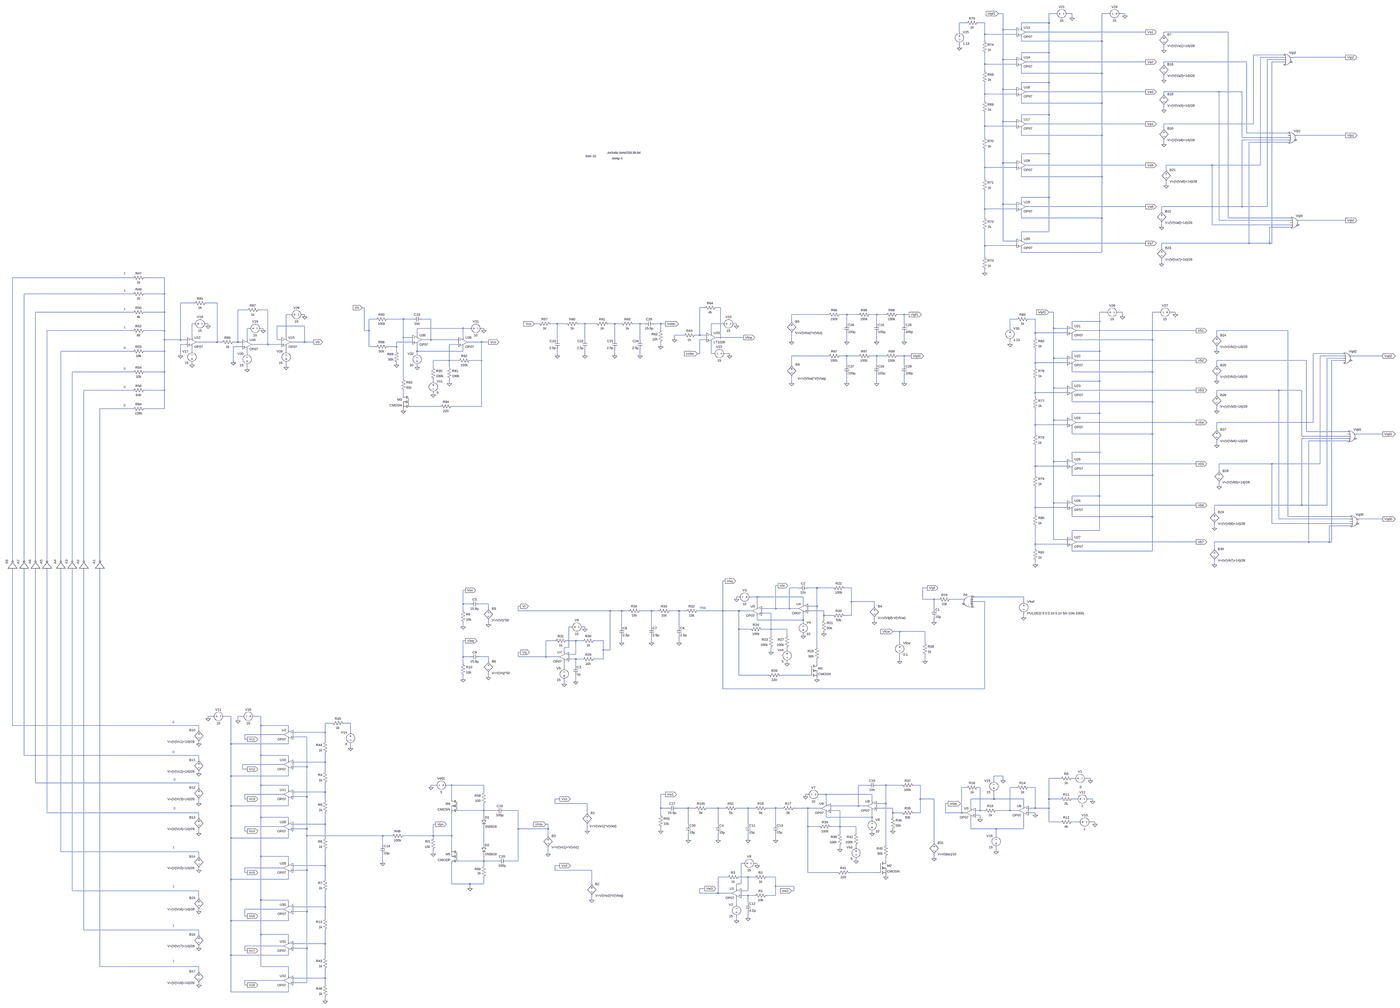
[diagram p0: schematic Internship.asc, whole sheet]
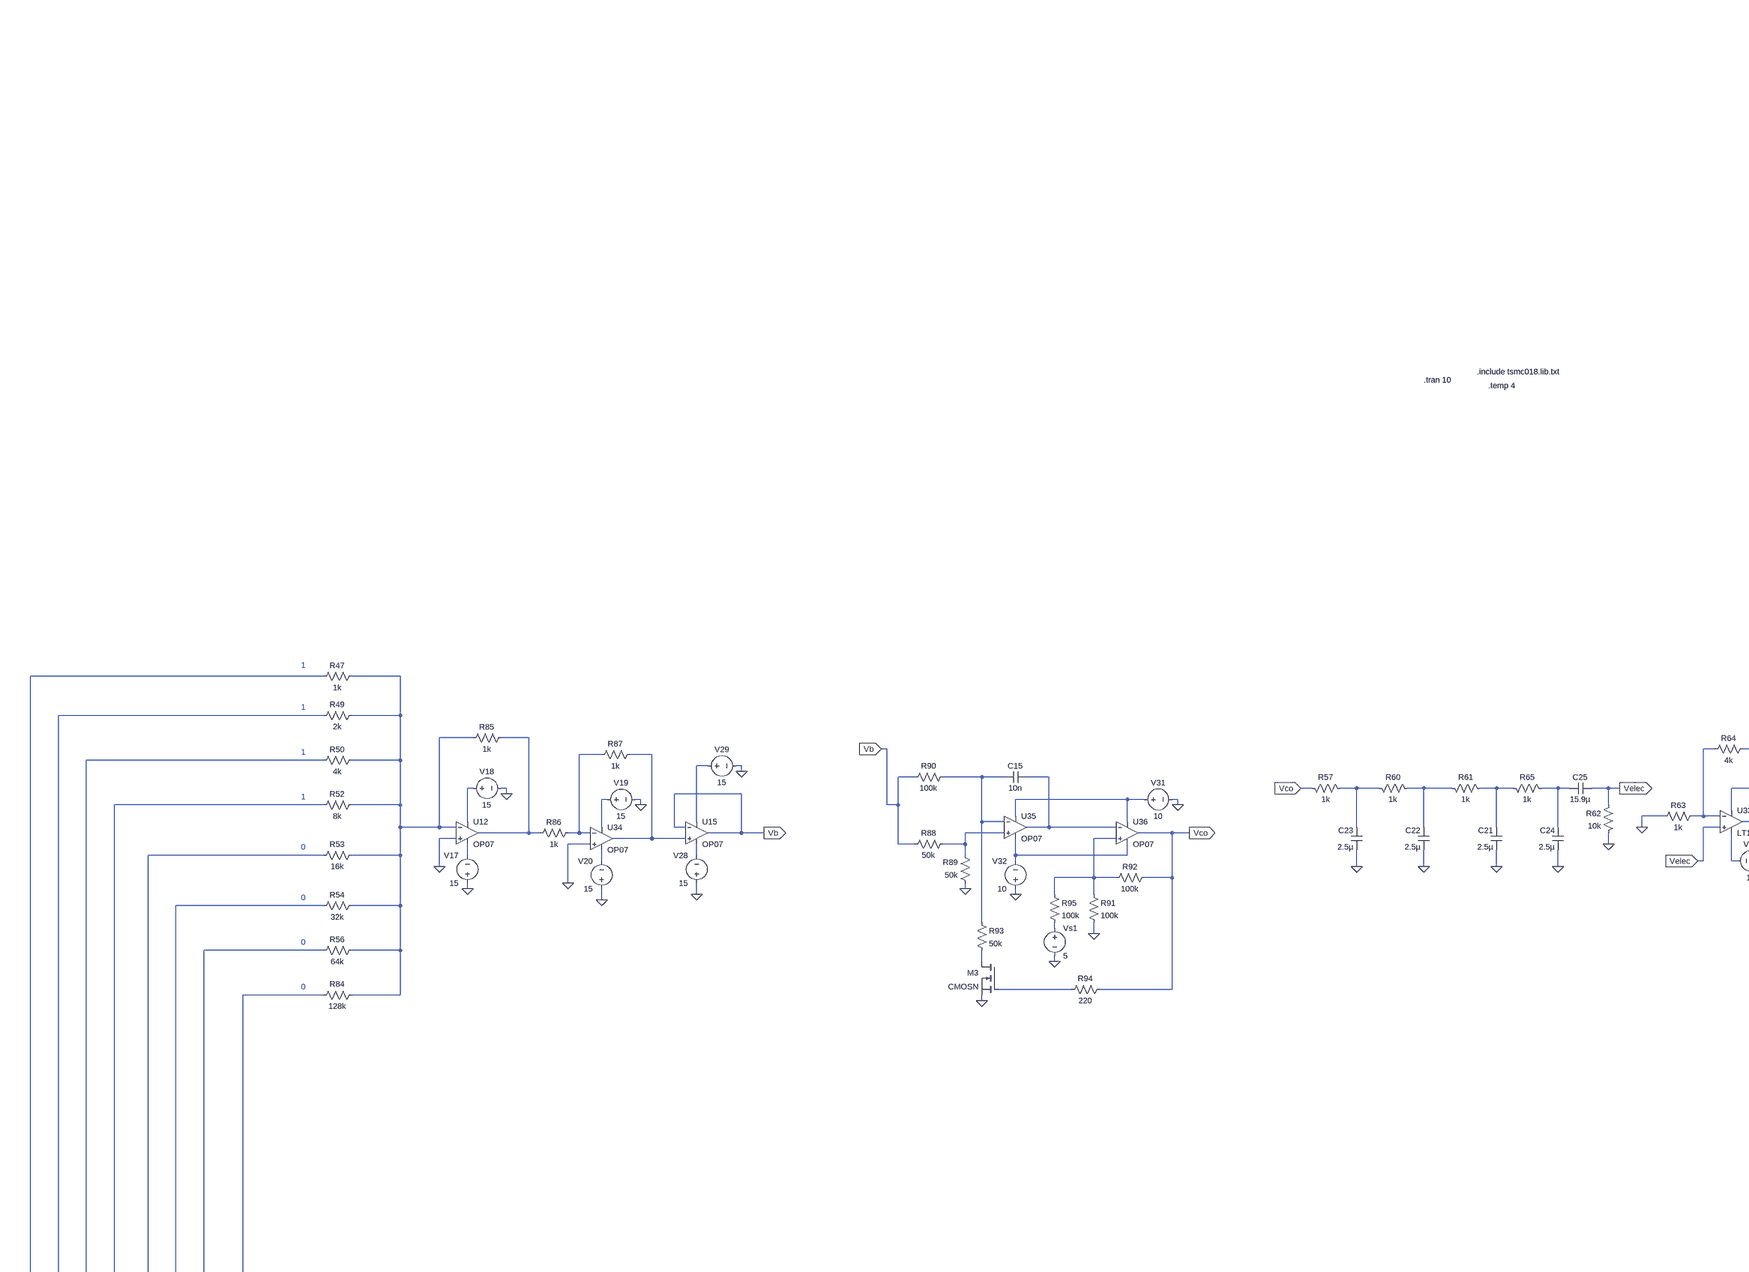
[diagram p1: schematic Internship.asc, part, row 1 of 2, column 1 of 2]
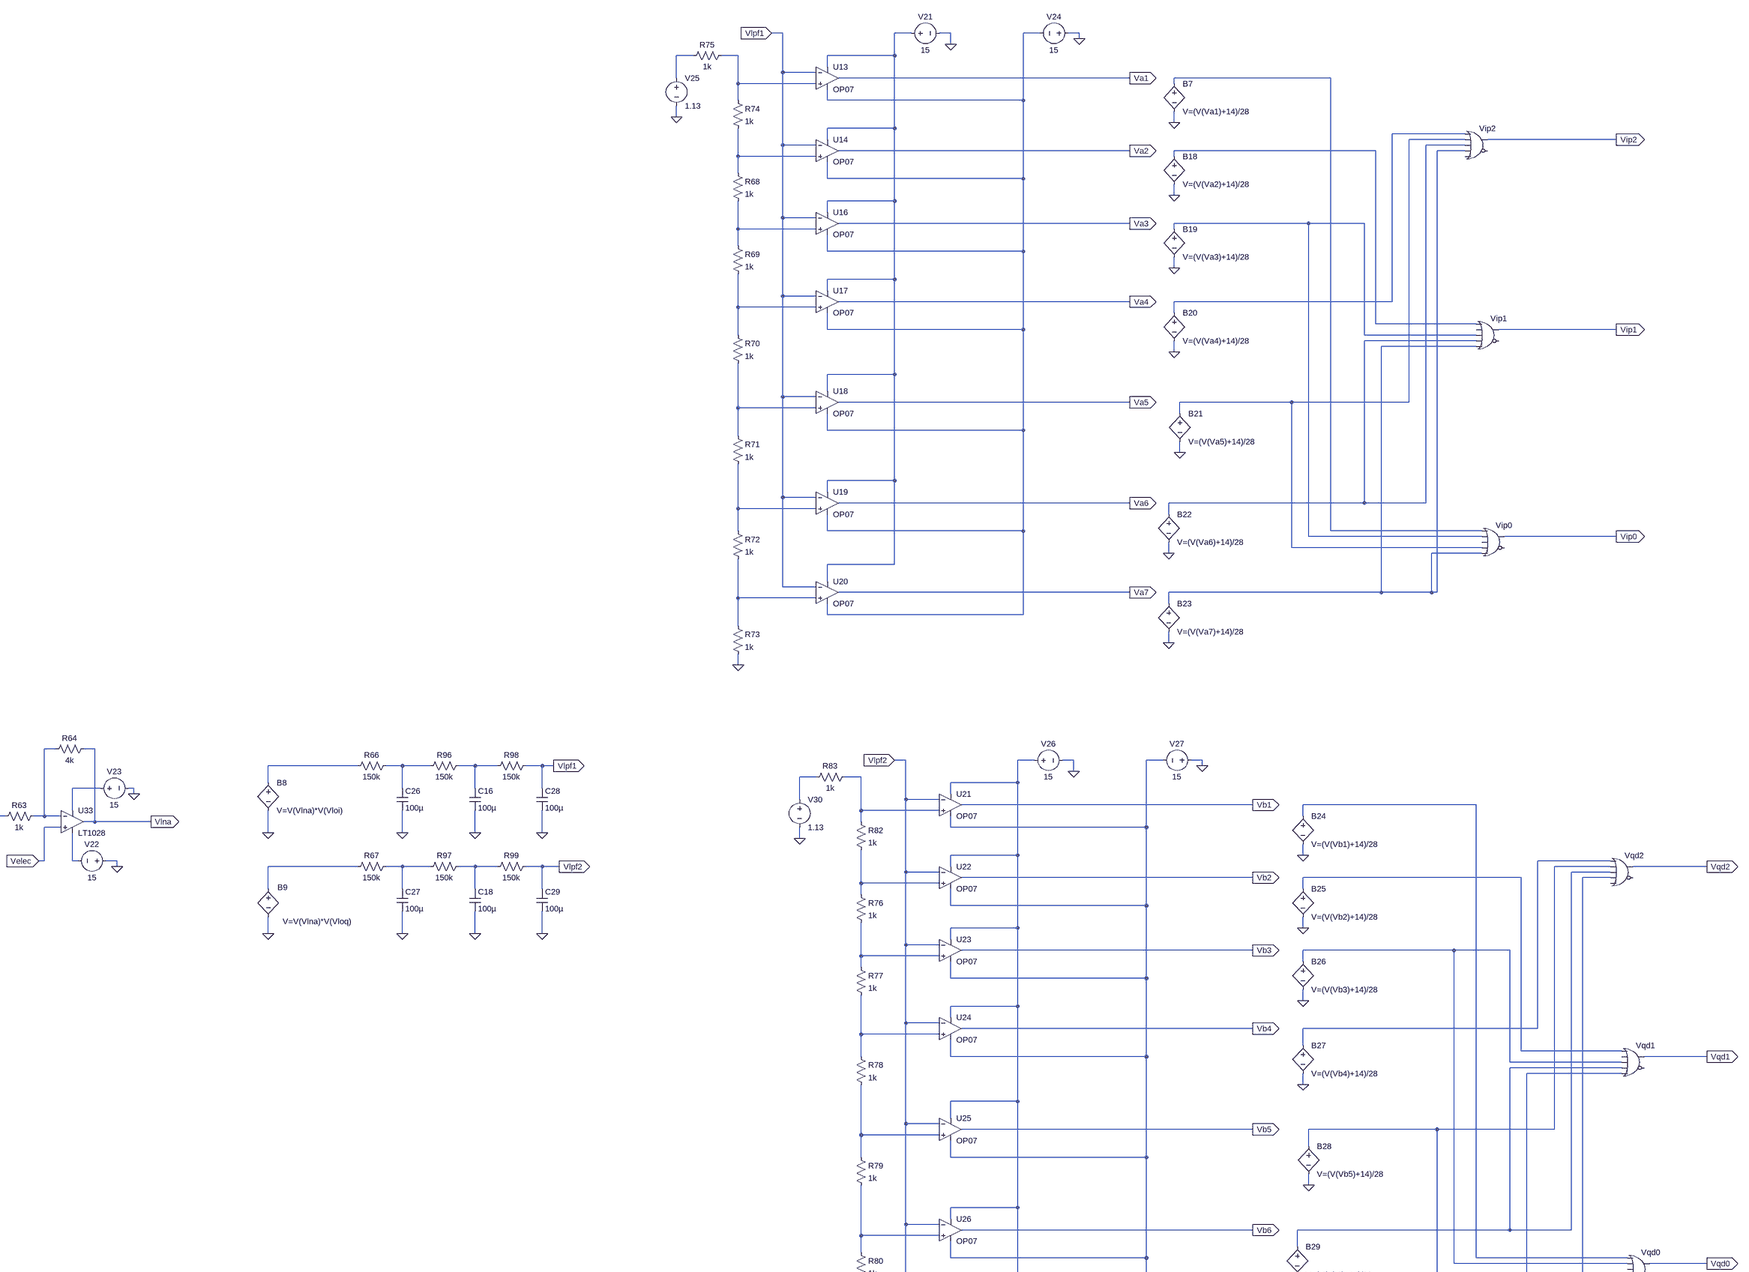
[diagram p2: schematic Internship.asc, part, row 1 of 2, column 2 of 2]
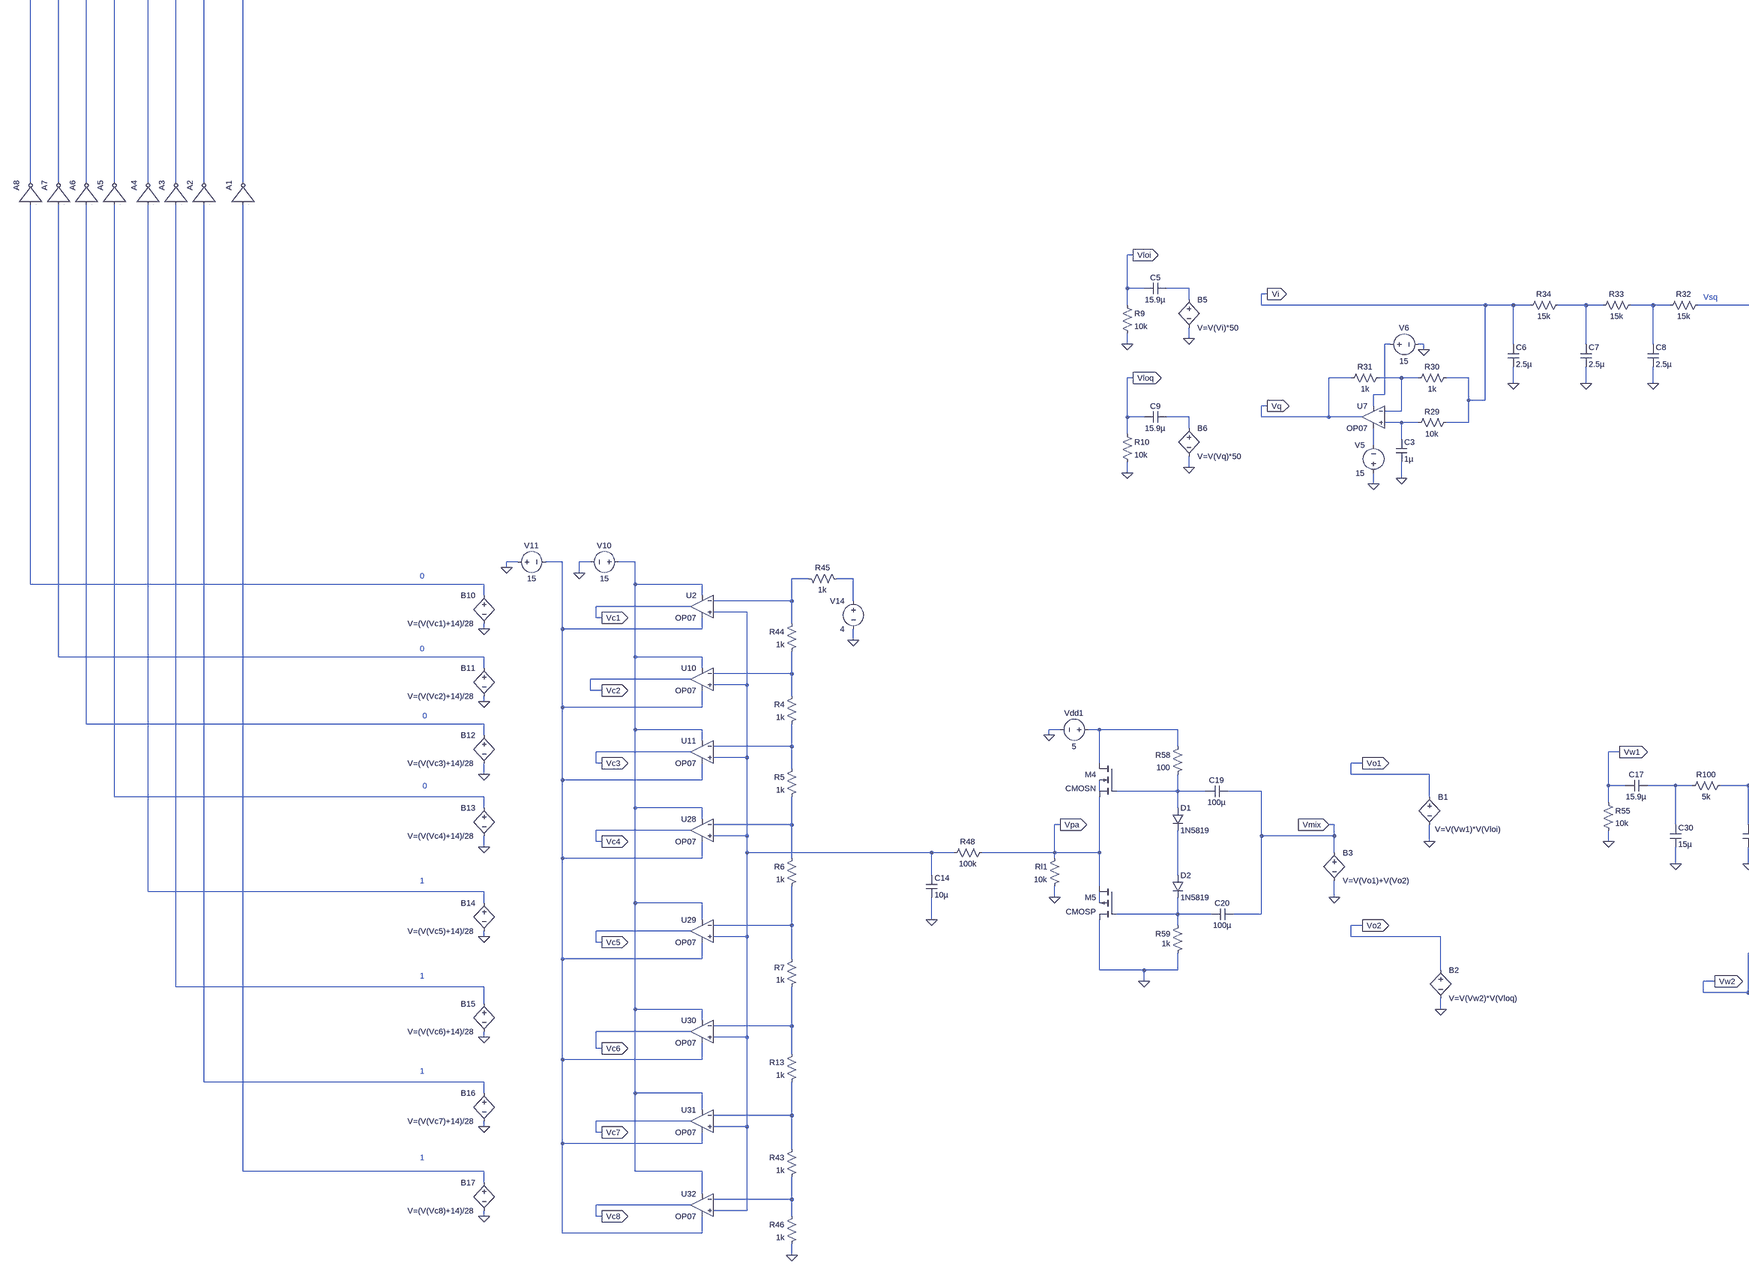
[diagram p3: schematic Internship.asc, part, row 2 of 2, column 1 of 2]
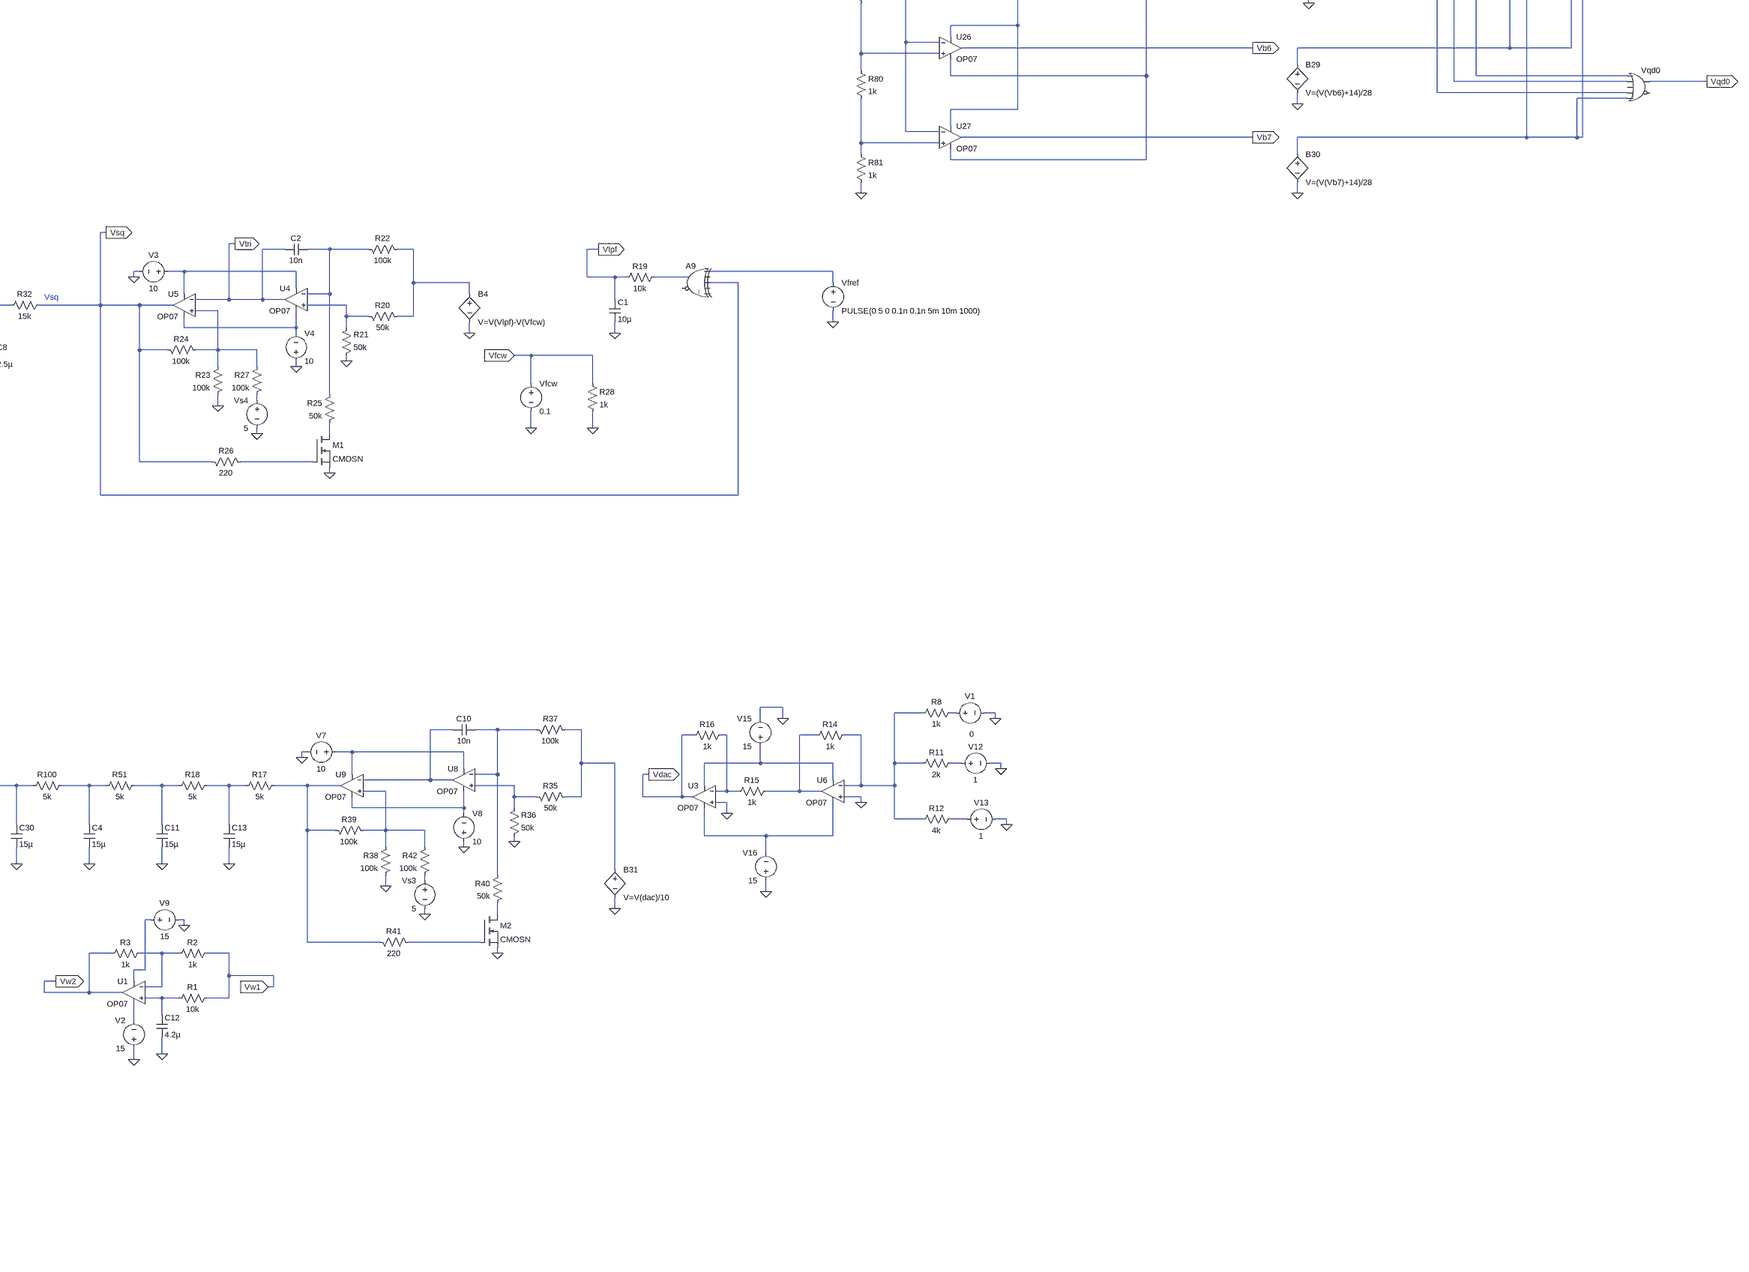
[diagram p4: schematic Internship.asc, part, row 2 of 2, column 2 of 2]
* Internship.asc
X§U3 0 N109 N113 N128 Vdac LT1001  ; OP07, pins In+ In- V+ V- OUT
X§U6 0 N102 N113 N128 N110 LT1001  ; OP07, pins In+ In- V+ V- OUT
R8 N103 N102 1k
R11 N114 N102 2k
R12 N126 N102 4k
V1 N103 0 0
V12 N114 0 1
V13 N126 0 1
R14 N102 N110 1k
R15 N110 N109 1k
R16 N109 Vdac 1k
V15 N113 0 15
V16 0 N128 15
B1 Vo1 0 V=V(Vw1)*V(Vloi)
B2 Vo2 0 V=V(Vw2)*V(Vloq)
Vfref N078 0 PULSE(0 5 0 0.1n 0.1n 5m 10m 1000)
A9 N078 0 Vsq 0 0 0 N079 0 XOR
R19 N079 Vlpf 10k
C1 Vlpf 0 10µ
X§U4 N083 N075 N077 N085 Vtri LT1001  ; OP07, pins In+ In- V+ V- OUT
X§U5 N084 Vtri N077 N085 Vsq LT1001  ; OP07, pins In+ In- V+ V- OUT
R20 N083 N076 50k
R21 0 N083 50k
R22 N075 N076 100k
C2 Vtri N075 10n
R23 N084 0 100k
R24 Vsq N084 100k
R25 N075 N091 50k
R26 Vsq N093 220
V3 N077 0 10
V4 0 N085 10
M1 N091 N093 0 0 CMOSN
R27 N084 N088 100k
Vs4 N088 0 5
B4 N076 0 V=V(Vlpf)-V(Vfcw)
Vfcw Vfcw 0 0.1
R28 Vfcw 0 1k
X§U7 N090 N087 N086 N092 Vq LT1001  ; OP07, pins In+ In- V+ V- OUT
C3 N090 0 1µ
R29 Vi N090 10k
R30 Vi N087 1k
R31 N087 Vq 1k
V5 0 N092 15
V6 N086 0 15
R32 Vsq N082 15k
R33 N082 N081 15k
R34 N081 Vi 15k
C6 Vi 0 2.5µ
C7 N081 0 2.5µ
C8 N082 0 2.5µ
B5 N080 0 V=V(Vi)*50
B6 N089 0 V=V(Vq)*50
X§U8 N120 N107 N112 N125 N106 LT1001  ; OP07, pins In+ In- V+ V- OUT
X§U9 N123 N106 N112 N125 N119 LT1001  ; OP07, pins In+ In- V+ V- OUT
R35 N120 N108 50k
R36 0 N120 50k
R37 N107 N108 100k
C10 N106 N107 10n
R38 N123 0 100k
R39 N119 N123 100k
R40 N107 N134 50k
R41 N119 N137 220
V7 N112 0 10
V8 0 N125 10
M2 N134 N137 0 0 CMOSN
R42 N123 N130 100k
Vs3 N130 0 5
C5 N080 Vloi 15.9µ
C9 N089 Vloq 15.9µ
R9 Vloi 0 10k
R10 Vloq 0 10k
R17 N119 N118 5k
R18 N118 N117 5k
R51 N117 N116 5k
C4 N116 0 15µ
C11 N117 0 15µ
C13 N118 0 15µ
C17 N115 Vw1 15.9µ
R55 Vw1 0 10k
B3 Vmix 0 V=V(Vo1)+V(Vo2)
M4 N105 N122 Vpa N121 CMOSN l=0.2u w=10u
M5 Vpa N133 0 N132 CMOSP l=0.2u w=20u
R58 N105 N122 100
R59 N133 0 1k
Vdd1 N105 0 5
Rl1 Vpa 0 10k
X§U15 N024 Vb N028 N050 Vb LT1001  ; OP07, pins In+ In- V+ V- OUT
V28 0 N050 15
V29 N028 0 15
R63 N022 0 1k
R64 Vlna N022 4k
V22 0 N053 15
V23 N041 0 15
D1 N122 N129 1N5819
D2 N129 N133 1N5819
C19 Vmix N122 100µ
C20 Vmix N133 100µ
R57 Vco N037 1k
R60 N037 N038 1k
R61 N038 N039 1k
C21 N039 0 2.5µ
C22 N038 0 2.5µ
C23 N037 0 2.5µ
C25 N040 Velec 15.9µ
R62 Velec 0 10k
R65 N039 N040 1k
C24 N040 0 2.5µ
B8 N029 0 V=V(Vlna)*V(Vloi)
B9 N055 0 V=V(Vlna)*V(Vloq)
R66 N030 N029 150k
C26 N030 0 100µ
R67 N056 N055 150k
C27 N056 0 100µ
X§U13 N004 Vlpf1 N001 N002 Va1 LT1001  ; OP07, pins In+ In- V+ V- OUT
X§U14 N011 Vlpf1 N001 N002 Va2 LT1001  ; OP07, pins In+ In- V+ V- OUT
X§U16 N013 Vlpf1 N001 N002 Va3 LT1001  ; OP07, pins In+ In- V+ V- OUT
X§U17 N014 Vlpf1 N001 N002 Va4 LT1001  ; OP07, pins In+ In- V+ V- OUT
X§U18 N015 Vlpf1 N001 N002 Va5 LT1001  ; OP07, pins In+ In- V+ V- OUT
X§U19 N016 Vlpf1 N001 N002 Va6 LT1001  ; OP07, pins In+ In- V+ V- OUT
X§U20 N017 Vlpf1 N001 N002 Va7 LT1001  ; OP07, pins In+ In- V+ V- OUT
V21 N001 0 15
V24 0 N002 15
V25 N003 0 1.13
R68 N011 N013 1k
R69 N013 N014 1k
R70 N014 N015 1k
R71 N015 N016 1k
R72 N016 N017 1k
R73 N017 0 1k
R74 N004 N011 1k
R75 N004 N003 1k
A§Vip2 N006 N007 N008 N010 0 0 Vip2 0 OR
A§Vip1 N009 0 N012 N008 N010 0 Vip1 0 OR
A§Vip0 N005 N012 0 N007 N010 0 Vip0 0 OR
X§U21 N035 Vlpf2 N026 N027 Vb1 LT1001  ; OP07, pins In+ In- V+ V- OUT
X§U22 N062 Vlpf2 N026 N027 Vb2 LT1001  ; OP07, pins In+ In- V+ V- OUT
X§U23 N067 Vlpf2 N026 N027 Vb3 LT1001  ; OP07, pins In+ In- V+ V- OUT
X§U24 N071 Vlpf2 N026 N027 Vb4 LT1001  ; OP07, pins In+ In- V+ V- OUT
X§U25 N072 Vlpf2 N026 N027 Vb5 LT1001  ; OP07, pins In+ In- V+ V- OUT
X§U26 N073 Vlpf2 N026 N027 Vb6 LT1001  ; OP07, pins In+ In- V+ V- OUT
X§U27 N074 Vlpf2 N026 N027 Vb7 LT1001  ; OP07, pins In+ In- V+ V- OUT
V26 N026 0 15
V27 0 N027 15
V30 N034 0 1.13
R76 N062 N067 1k
R77 N067 N071 1k
R78 N071 N072 1k
R79 N072 N073 1k
R80 N073 N074 1k
R81 N074 0 1k
R82 N035 N062 1k
R83 N035 N034 1k
A§Vqd2 N054 N058 N059 N061 0 0 Vqd2 0 OR
A§Vqd1 N060 0 N066 N059 N061 0 Vqd1 0 OR
A§Vqd0 N045 N066 0 N058 N061 0 Vqd0 0 OR
X§U1 N140 N138 N135 N141 Vw2 LT1001  ; OP07, pins In+ In- V+ V- OUT
C12 N140 0 4.2µ
R1 Vw1 N140 10k
R2 Vw1 N138 1k
R3 N138 Vw2 1k
V2 0 N141 15
V9 N135 0 15
X§U2 N099 N096 N095 N094 Vc1 LT1001  ; OP07, pins In+ In- V+ V- OUT
X§U10 N099 N101 N095 N094 Vc2 LT1001  ; OP07, pins In+ In- V+ V- OUT
X§U11 N099 N111 N095 N094 Vc3 LT1001  ; OP07, pins In+ In- V+ V- OUT
X§U28 N099 N127 N095 N094 Vc4 LT1001  ; OP07, pins In+ In- V+ V- OUT
X§U29 N099 N136 N095 N094 Vc5 LT1001  ; OP07, pins In+ In- V+ V- OUT
X§U30 N099 N142 N095 N094 Vc6 LT1001  ; OP07, pins In+ In- V+ V- OUT
X§U31 N099 N144 N095 N094 Vc7 LT1001  ; OP07, pins In+ In- V+ V- OUT
V10 N095 0 15
V11 0 N094 15
V14 N097 0 4
R4 N101 N111 1k
R5 N111 N127 1k
R6 N127 N136 1k
R7 N136 N142 1k
R13 N142 N144 1k
R43 N144 N146 1k
R44 N096 N101 1k
R45 N096 N097 1k
X§U32 N099 N146 N095 N094 Vc8 LT1001  ; OP07, pins In+ In- V+ V- OUT
R46 N146 0 1k
R48 Vpa N099 100k
C14 N099 0 10µ
B10 N098 0 V=(V(Vc1)+14)/28
B11 N100 0 V=(V(Vc2)+14)/28
B12 N104 0 V=(V(Vc3)+14)/28
B13 N124 0 V=(V(Vc4)+14)/28
B14 N131 0 V=(V(Vc5)+14)/28
B15 N139 0 V=(V(Vc6)+14)/28
B16 N143 0 V=(V(Vc7)+14)/28
B17 N145 0 V=(V(Vc8)+14)/28
X§U33 Velec N022 N041 N053 Vlna LT1028  ; pins In+ In- V+ V- OUT
A1 N145 0 0 0 0 N070 0 0 BUF
A2 N143 0 0 0 0 N065 0 0 BUF
A3 N139 0 0 0 0 N063 0 0 BUF
A4 N131 0 0 0 0 N048 0 0 BUF
A5 N124 0 0 0 0 N044 0 0 BUF
A6 N104 0 0 0 0 N025 0 0 BUF
A7 N100 0 0 0 0 N020 0 0 BUF
A8 N098 0 0 0 0 N018 0 0 BUF
R47 N019 N018 1k
R49 N019 N020 2k
R50 N019 N025 4k
R52 N019 N044 8k
R53 N019 N048 16k
R54 N019 N063 32k
R56 N019 N065 64k
R84 N019 N070 128k
X§U12 0 N019 N036 N049 N021 LT1001  ; OP07, pins In+ In- V+ V- OUT
V17 0 N049 15
V18 N036 0 15
R85 N021 N019 1k
X§U34 0 N023 N042 N052 N024 LT1001  ; OP07, pins In+ In- V+ V- OUT
V19 N042 0 15
V20 0 N052 15
R87 N024 N023 1k
R86 N023 N021 1k
X§U35 N046 N032 N043 N051 N033 LT1001  ; OP07, pins In+ In- V+ V- OUT
X§U36 N047 N033 N043 N051 Vco LT1001  ; OP07, pins In+ In- V+ V- OUT
R88 N046 Vb 50k
R89 0 N046 50k
R90 N032 Vb 100k
C15 N033 N032 10n
R91 N047 0 100k
R92 Vco N047 100k
R93 N032 N068 50k
R94 Vco N069 220
V31 N043 0 10
V32 0 N051 10
M3 N068 N069 0 0 CMOSN
R95 N047 N064 100k
Vs1 N064 0 5
B7 N005 0 V=(V(Va1)+14)/28
B18 N009 0 V=(V(Va2)+14)/28
B19 N012 0 V=(V(Va3)+14)/28
B20 N006 0 V=(V(Va4)+14)/28
B21 N007 0 V=(V(Va5)+14)/28
B22 N008 0 V=(V(Va6)+14)/28
B23 N010 0 V=(V(Va7)+14)/28
B24 N045 0 V=(V(Vb1)+14)/28
B25 N060 0 V=(V(Vb2)+14)/28
B26 N066 0 V=(V(Vb3)+14)/28
B27 N054 0 V=(V(Vb4)+14)/28
B28 N058 0 V=(V(Vb5)+14)/28
B29 N059 0 V=(V(Vb6)+14)/28
B30 N061 0 V=(V(Vb7)+14)/28
R96 N031 N030 150k
C16 N031 0 100µ
R97 N057 N056 150k
C18 N057 0 100µ
R99 Vlpf2 N057 150k
C29 Vlpf2 0 100µ
R100 N116 N115 5k
C30 N115 0 15µ
R98 Vlpf1 N031 150k
C28 Vlpf1 0 100µ
B31 N108 0 V=V(dac)/10
.model D D
.lib standard.dio
.model NMOS NMOS
.model PMOS PMOS
.lib standard.mos
.tran 10
.include tsmc018.lib.txt
.temp 4
* 0
* 0
* 0
* 0
* 1
* 1
* 1
* 1
* 1
* 1
* 1
* 1
* 0
* 0
* 0
* 0
* Vsq
.lib LTC.lib
.backanno
.end